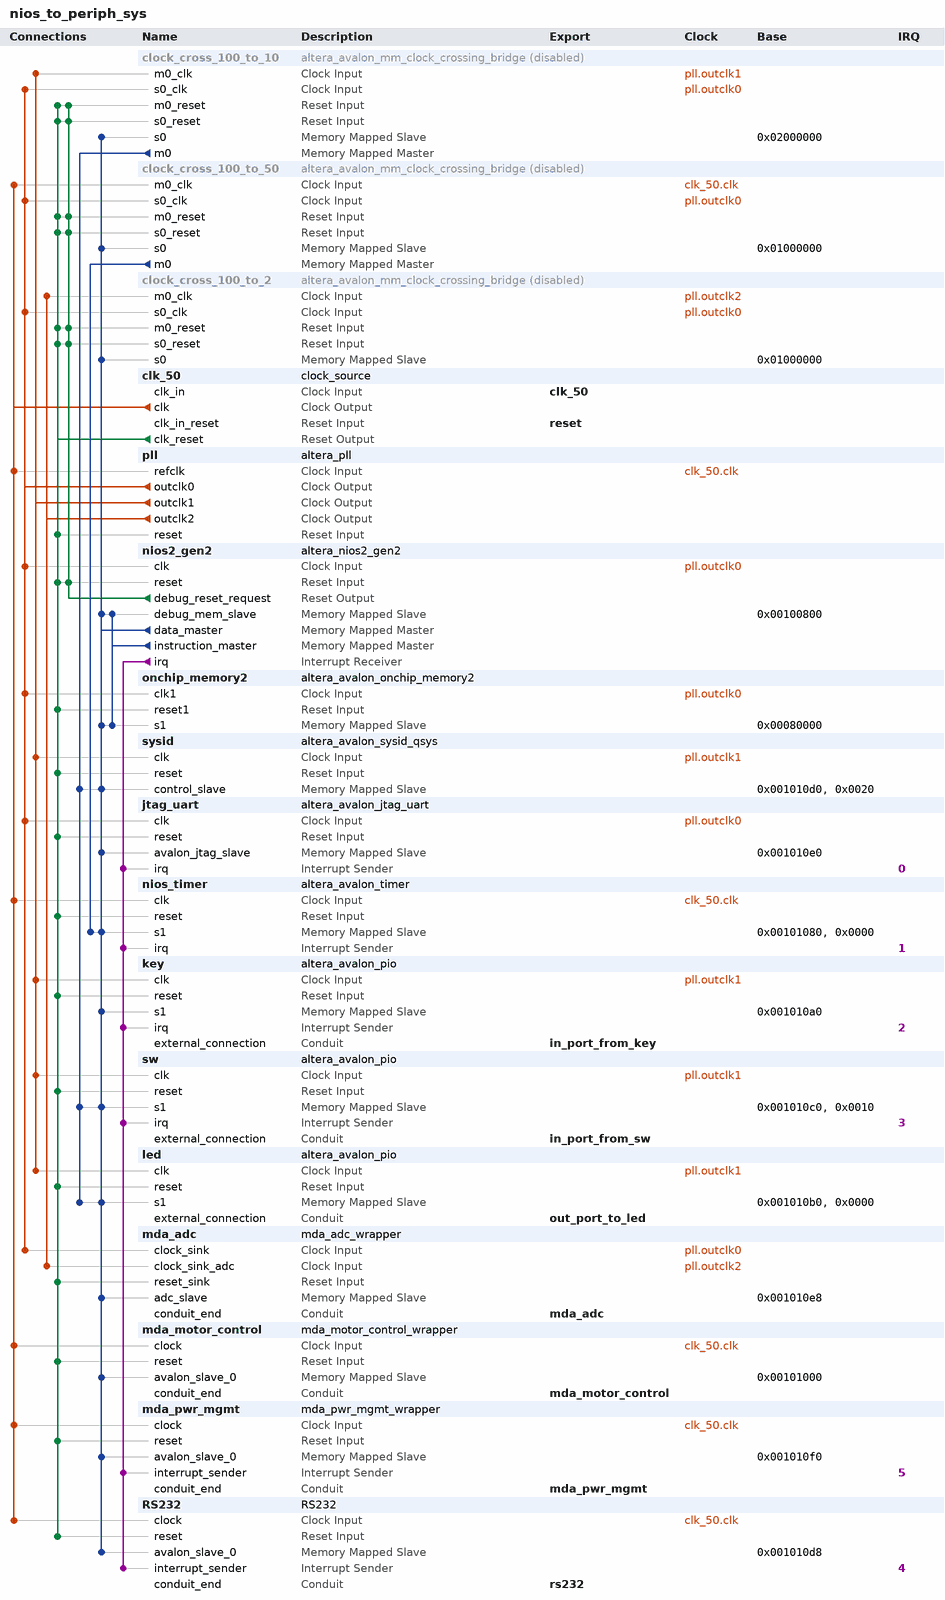
[diagram p0: system contents]
# Platform Designer (Qsys) system nios_to_periph_sys, Cyclone V 5CSEMA4U23C6
# Parameters at their usual value, and those the tool derives, are not listed.
package require -exact qsys 15.1
create_system nios_to_periph_sys
set_project_property DEVICE_FAMILY {Cyclone V}
set_project_property DEVICE 5CSEMA4U23C6

add_instance clock_cross_100_to_10 altera_avalon_mm_clock_crossing_bridge 15.1
set_instance_property clock_cross_100_to_10 ENABLED false
set_instance_parameter_value clock_cross_100_to_10 ADDRESS_WIDTH 10
set_instance_parameter_value clock_cross_100_to_10 COMMAND_FIFO_DEPTH 16
set_instance_parameter_value clock_cross_100_to_10 DATA_WIDTH 32
set_instance_parameter_value clock_cross_100_to_10 MASTER_SYNC_DEPTH 2
set_instance_parameter_value clock_cross_100_to_10 MAX_BURST_SIZE 1
set_instance_parameter_value clock_cross_100_to_10 RESPONSE_FIFO_DEPTH 32
set_instance_parameter_value clock_cross_100_to_10 SLAVE_SYNC_DEPTH 2
set_instance_parameter_value clock_cross_100_to_10 USE_AUTO_ADDRESS_WIDTH 1

add_instance clock_cross_100_to_50 altera_avalon_mm_clock_crossing_bridge 15.1
set_instance_property clock_cross_100_to_50 ENABLED false
set_instance_parameter_value clock_cross_100_to_50 ADDRESS_WIDTH 10
set_instance_parameter_value clock_cross_100_to_50 COMMAND_FIFO_DEPTH 16
set_instance_parameter_value clock_cross_100_to_50 DATA_WIDTH 32
set_instance_parameter_value clock_cross_100_to_50 MASTER_SYNC_DEPTH 3
set_instance_parameter_value clock_cross_100_to_50 MAX_BURST_SIZE 1
set_instance_parameter_value clock_cross_100_to_50 RESPONSE_FIFO_DEPTH 32
set_instance_parameter_value clock_cross_100_to_50 SLAVE_SYNC_DEPTH 3
set_instance_parameter_value clock_cross_100_to_50 USE_AUTO_ADDRESS_WIDTH 1

add_instance clock_cross_100_to_2 altera_avalon_mm_clock_crossing_bridge 15.1
set_instance_property clock_cross_100_to_2 ENABLED false
set_instance_parameter_value clock_cross_100_to_2 ADDRESS_WIDTH 7
set_instance_parameter_value clock_cross_100_to_2 COMMAND_FIFO_DEPTH 16
set_instance_parameter_value clock_cross_100_to_2 DATA_WIDTH 32
set_instance_parameter_value clock_cross_100_to_2 MASTER_SYNC_DEPTH 3
set_instance_parameter_value clock_cross_100_to_2 MAX_BURST_SIZE 1
set_instance_parameter_value clock_cross_100_to_2 RESPONSE_FIFO_DEPTH 32
set_instance_parameter_value clock_cross_100_to_2 SLAVE_SYNC_DEPTH 3
set_instance_parameter_value clock_cross_100_to_2 USE_AUTO_ADDRESS_WIDTH 1

add_instance clk_50 clock_source 15.1
set_instance_parameter_value clk_50 clockFrequency 50000000

add_instance pll altera_pll 15.1
set_instance_parameter_value pll gui_device_speed_grade 1
set_instance_parameter_value pll gui_number_of_clocks 3
set_instance_parameter_value pll gui_operation_mode normal
set_instance_parameter_value pll gui_output_clock_frequency0 100.0
set_instance_parameter_value pll gui_output_clock_frequency1 10.0
set_instance_parameter_value pll gui_output_clock_frequency2 40.0
set_instance_parameter_value pll gui_pll_mode {Integer-N PLL}
set_instance_parameter_value pll gui_reference_clock_frequency 50.0
set_instance_parameter_value pll gui_use_locked false

add_instance nios2_gen2 altera_nios2_gen2 15.1
set_instance_parameter_value nios2_gen2 dcache_size 2048
set_instance_parameter_value nios2_gen2 exceptionSlave onchip_memory2.s1
set_instance_parameter_value nios2_gen2 icache_size 4096
set_instance_parameter_value nios2_gen2 impl Tiny
set_instance_parameter_value nios2_gen2 resetSlave onchip_memory2.s1

add_instance onchip_memory2 altera_avalon_onchip_memory2 15.1
set_instance_parameter_value onchip_memory2 dataWidth 16
set_instance_parameter_value onchip_memory2 dualPort false
set_instance_parameter_value onchip_memory2 initMemContent true
set_instance_parameter_value onchip_memory2 initializationFileName onchip_mem.hex
set_instance_parameter_value onchip_memory2 memorySize 266162

add_instance sysid altera_avalon_sysid_qsys 15.1
set_instance_parameter_value sysid id -559038737

add_instance jtag_uart altera_avalon_jtag_uart 15.1
set_instance_parameter_value jtag_uart simInteractiveOptions NO_INTERACTIVE_WINDOWS

add_instance nios_timer altera_avalon_timer 15.1
set_instance_parameter_value nios_timer period 50000
set_instance_parameter_value nios_timer periodUnits CLOCKS

add_instance key altera_avalon_pio 15.1
set_instance_parameter_value key captureEdge true
set_instance_parameter_value key direction Input
set_instance_parameter_value key edgeType FALLING
set_instance_parameter_value key generateIRQ true
set_instance_parameter_value key irqType EDGE
set_instance_parameter_value key width 2

add_instance sw altera_avalon_pio 15.1
set_instance_parameter_value sw captureEdge true
set_instance_parameter_value sw direction Input
set_instance_parameter_value sw edgeType ANY
set_instance_parameter_value sw generateIRQ true
set_instance_parameter_value sw irqType EDGE
set_instance_parameter_value sw width 4

add_instance led altera_avalon_pio 15.1
set_instance_parameter_value led direction Output
set_instance_parameter_value led width 8

add_instance mda_adc mda_adc_wrapper 1.0

add_instance mda_motor_control mda_motor_control_wrapper 1.0

add_instance mda_pwr_mgmt mda_pwr_mgmt_wrapper 1.0

add_instance RS232 RS232 1.0
set_instance_parameter_value RS232 BAUD_COUNTER_WIDTH 9
set_instance_parameter_value RS232 BAUD_TICK_COUNT 433
set_instance_parameter_value RS232 BAUD_TICK_INCREMENT 1
set_instance_parameter_value RS232 DATA_WIDTH 8
set_instance_parameter_value RS232 HALF_BAUD_TICK_COUNT 216
set_instance_parameter_value RS232 ODD_PARITY 0
set_instance_parameter_value RS232 TOTAL_DATA_WIDTH 10

# connections
add_connection clk_50.clk clock_cross_100_to_50.m0_clk clock
add_connection clk_50.clk mda_motor_control.clock clock
add_connection clk_50.clk mda_pwr_mgmt.clock clock
add_connection clk_50.clk nios_timer.clk clock
add_connection clk_50.clk pll.refclk clock
add_connection clk_50.clk RS232.clock clock
add_connection pll.outclk0 clock_cross_100_to_2.s0_clk clock
add_connection pll.outclk0 clock_cross_100_to_10.s0_clk clock
add_connection pll.outclk0 clock_cross_100_to_50.s0_clk clock
add_connection pll.outclk0 jtag_uart.clk clock
add_connection pll.outclk0 mda_adc.clock_sink clock
add_connection pll.outclk0 nios2_gen2.clk clock
add_connection pll.outclk0 onchip_memory2.clk1 clock
add_connection pll.outclk1 clock_cross_100_to_10.m0_clk clock
add_connection pll.outclk1 key.clk clock
add_connection pll.outclk1 led.clk clock
add_connection pll.outclk1 sw.clk clock
add_connection pll.outclk1 sysid.clk clock
add_connection pll.outclk2 clock_cross_100_to_2.m0_clk clock
add_connection pll.outclk2 mda_adc.clock_sink_adc clock
add_connection clk_50.clk_reset clock_cross_100_to_2.m0_reset reset
add_connection clk_50.clk_reset clock_cross_100_to_2.s0_reset reset
add_connection clk_50.clk_reset clock_cross_100_to_10.m0_reset reset
add_connection clk_50.clk_reset clock_cross_100_to_10.s0_reset reset
add_connection clk_50.clk_reset clock_cross_100_to_50.m0_reset reset
add_connection clk_50.clk_reset clock_cross_100_to_50.s0_reset reset
add_connection clk_50.clk_reset jtag_uart.reset reset
add_connection clk_50.clk_reset key.reset reset
add_connection clk_50.clk_reset led.reset reset
add_connection clk_50.clk_reset mda_adc.reset_sink reset
add_connection clk_50.clk_reset mda_motor_control.reset reset
add_connection clk_50.clk_reset mda_pwr_mgmt.reset reset
add_connection clk_50.clk_reset nios2_gen2.reset reset
add_connection clk_50.clk_reset nios_timer.reset reset
add_connection clk_50.clk_reset onchip_memory2.reset1 reset
add_connection clk_50.clk_reset pll.reset reset
add_connection clk_50.clk_reset RS232.reset reset
add_connection clk_50.clk_reset sw.reset reset
add_connection clk_50.clk_reset sysid.reset reset
add_connection nios2_gen2.debug_reset_request clock_cross_100_to_2.m0_reset reset
add_connection nios2_gen2.debug_reset_request clock_cross_100_to_2.s0_reset reset
add_connection nios2_gen2.debug_reset_request clock_cross_100_to_10.m0_reset reset
add_connection nios2_gen2.debug_reset_request clock_cross_100_to_10.s0_reset reset
add_connection nios2_gen2.debug_reset_request clock_cross_100_to_50.m0_reset reset
add_connection nios2_gen2.debug_reset_request clock_cross_100_to_50.s0_reset reset
add_connection nios2_gen2.debug_reset_request nios2_gen2.reset reset
add_connection clock_cross_100_to_10.m0 led.s1 avalon
set_connection_parameter_value clock_cross_100_to_10.m0/led.s1 baseAddress 0x0000
add_connection clock_cross_100_to_10.m0 sw.s1 avalon
set_connection_parameter_value clock_cross_100_to_10.m0/sw.s1 baseAddress 0x0010
add_connection clock_cross_100_to_10.m0 sysid.control_slave avalon
set_connection_parameter_value clock_cross_100_to_10.m0/sysid.control_slave baseAddress 0x0020
add_connection clock_cross_100_to_50.m0 nios_timer.s1 avalon
set_connection_parameter_value clock_cross_100_to_50.m0/nios_timer.s1 baseAddress 0x0000
add_connection nios2_gen2.data_master clock_cross_100_to_2.s0 avalon
set_connection_parameter_value nios2_gen2.data_master/clock_cross_100_to_2.s0 baseAddress 0x01000000
add_connection nios2_gen2.data_master clock_cross_100_to_10.s0 avalon
set_connection_parameter_value nios2_gen2.data_master/clock_cross_100_to_10.s0 baseAddress 0x02000000
add_connection nios2_gen2.data_master clock_cross_100_to_50.s0 avalon
set_connection_parameter_value nios2_gen2.data_master/clock_cross_100_to_50.s0 baseAddress 0x01000000
add_connection nios2_gen2.data_master jtag_uart.avalon_jtag_slave avalon
set_connection_parameter_value nios2_gen2.data_master/jtag_uart.avalon_jtag_slave baseAddress 0x001010e0
add_connection nios2_gen2.data_master key.s1 avalon
set_connection_parameter_value nios2_gen2.data_master/key.s1 baseAddress 0x001010a0
add_connection nios2_gen2.data_master led.s1 avalon
set_connection_parameter_value nios2_gen2.data_master/led.s1 baseAddress 0x001010b0
add_connection nios2_gen2.data_master mda_adc.adc_slave avalon
set_connection_parameter_value nios2_gen2.data_master/mda_adc.adc_slave baseAddress 0x001010e8
add_connection nios2_gen2.data_master mda_motor_control.avalon_slave_0 avalon
set_connection_parameter_value nios2_gen2.data_master/mda_motor_control.avalon_slave_0 baseAddress 0x00101000
add_connection nios2_gen2.data_master mda_pwr_mgmt.avalon_slave_0 avalon
set_connection_parameter_value nios2_gen2.data_master/mda_pwr_mgmt.avalon_slave_0 baseAddress 0x001010f0
add_connection nios2_gen2.data_master nios2_gen2.debug_mem_slave avalon
set_connection_parameter_value nios2_gen2.data_master/nios2_gen2.debug_mem_slave baseAddress 0x00100800
add_connection nios2_gen2.data_master nios_timer.s1 avalon
set_connection_parameter_value nios2_gen2.data_master/nios_timer.s1 baseAddress 0x00101080
add_connection nios2_gen2.data_master onchip_memory2.s1 avalon
set_connection_parameter_value nios2_gen2.data_master/onchip_memory2.s1 baseAddress 0x00080000
add_connection nios2_gen2.data_master RS232.avalon_slave_0 avalon
set_connection_parameter_value nios2_gen2.data_master/RS232.avalon_slave_0 baseAddress 0x001010d8
add_connection nios2_gen2.data_master sw.s1 avalon
set_connection_parameter_value nios2_gen2.data_master/sw.s1 baseAddress 0x001010c0
add_connection nios2_gen2.data_master sysid.control_slave avalon
set_connection_parameter_value nios2_gen2.data_master/sysid.control_slave baseAddress 0x001010d0
add_connection nios2_gen2.instruction_master nios2_gen2.debug_mem_slave avalon
set_connection_parameter_value nios2_gen2.instruction_master/nios2_gen2.debug_mem_slave baseAddress 0x00100800
add_connection nios2_gen2.instruction_master onchip_memory2.s1 avalon
set_connection_parameter_value nios2_gen2.instruction_master/onchip_memory2.s1 baseAddress 0x00080000
add_connection nios2_gen2.irq jtag_uart.irq interrupt
set_connection_parameter_value nios2_gen2.irq/jtag_uart.irq irqNumber 0
add_connection nios2_gen2.irq key.irq interrupt
set_connection_parameter_value nios2_gen2.irq/key.irq irqNumber 2
add_connection nios2_gen2.irq mda_pwr_mgmt.interrupt_sender interrupt
set_connection_parameter_value nios2_gen2.irq/mda_pwr_mgmt.interrupt_sender irqNumber 5
add_connection nios2_gen2.irq nios_timer.irq interrupt
set_connection_parameter_value nios2_gen2.irq/nios_timer.irq irqNumber 1
add_connection nios2_gen2.irq RS232.interrupt_sender interrupt
set_connection_parameter_value nios2_gen2.irq/RS232.interrupt_sender irqNumber 4
add_connection nios2_gen2.irq sw.irq interrupt
set_connection_parameter_value nios2_gen2.irq/sw.irq irqNumber 3

# exported interfaces
add_interface clk_50 clock sink
set_interface_property clk_50 EXPORT_OF clk_50.clk_in
add_interface in_port_from_key conduit end
set_interface_property in_port_from_key EXPORT_OF key.external_connection
add_interface in_port_from_sw conduit end
set_interface_property in_port_from_sw EXPORT_OF sw.external_connection
add_interface mda_adc conduit end
set_interface_property mda_adc EXPORT_OF mda_adc.conduit_end
add_interface mda_motor_control conduit end
set_interface_property mda_motor_control EXPORT_OF mda_motor_control.conduit_end
add_interface mda_pwr_mgmt conduit end
set_interface_property mda_pwr_mgmt EXPORT_OF mda_pwr_mgmt.conduit_end
add_interface out_port_to_led conduit end
set_interface_property out_port_to_led EXPORT_OF led.external_connection
add_interface reset reset sink
set_interface_property reset EXPORT_OF clk_50.clk_in_reset
add_interface rs232 conduit end
set_interface_property rs232 EXPORT_OF RS232.conduit_end

set_interconnect_requirement {$system} qsys_mm.clockCrossingAdapter HANDSHAKE
set_interconnect_requirement {$system} qsys_mm.enableEccProtection FALSE
set_interconnect_requirement {$system} qsys_mm.insertDefaultSlave FALSE
set_interconnect_requirement {$system} qsys_mm.maxAdditionalLatency 1

save_system nios_to_periph_sys.qsys
